# EAGLE design quadESP_DevKit_v1 (EAGLE 9.6.2)
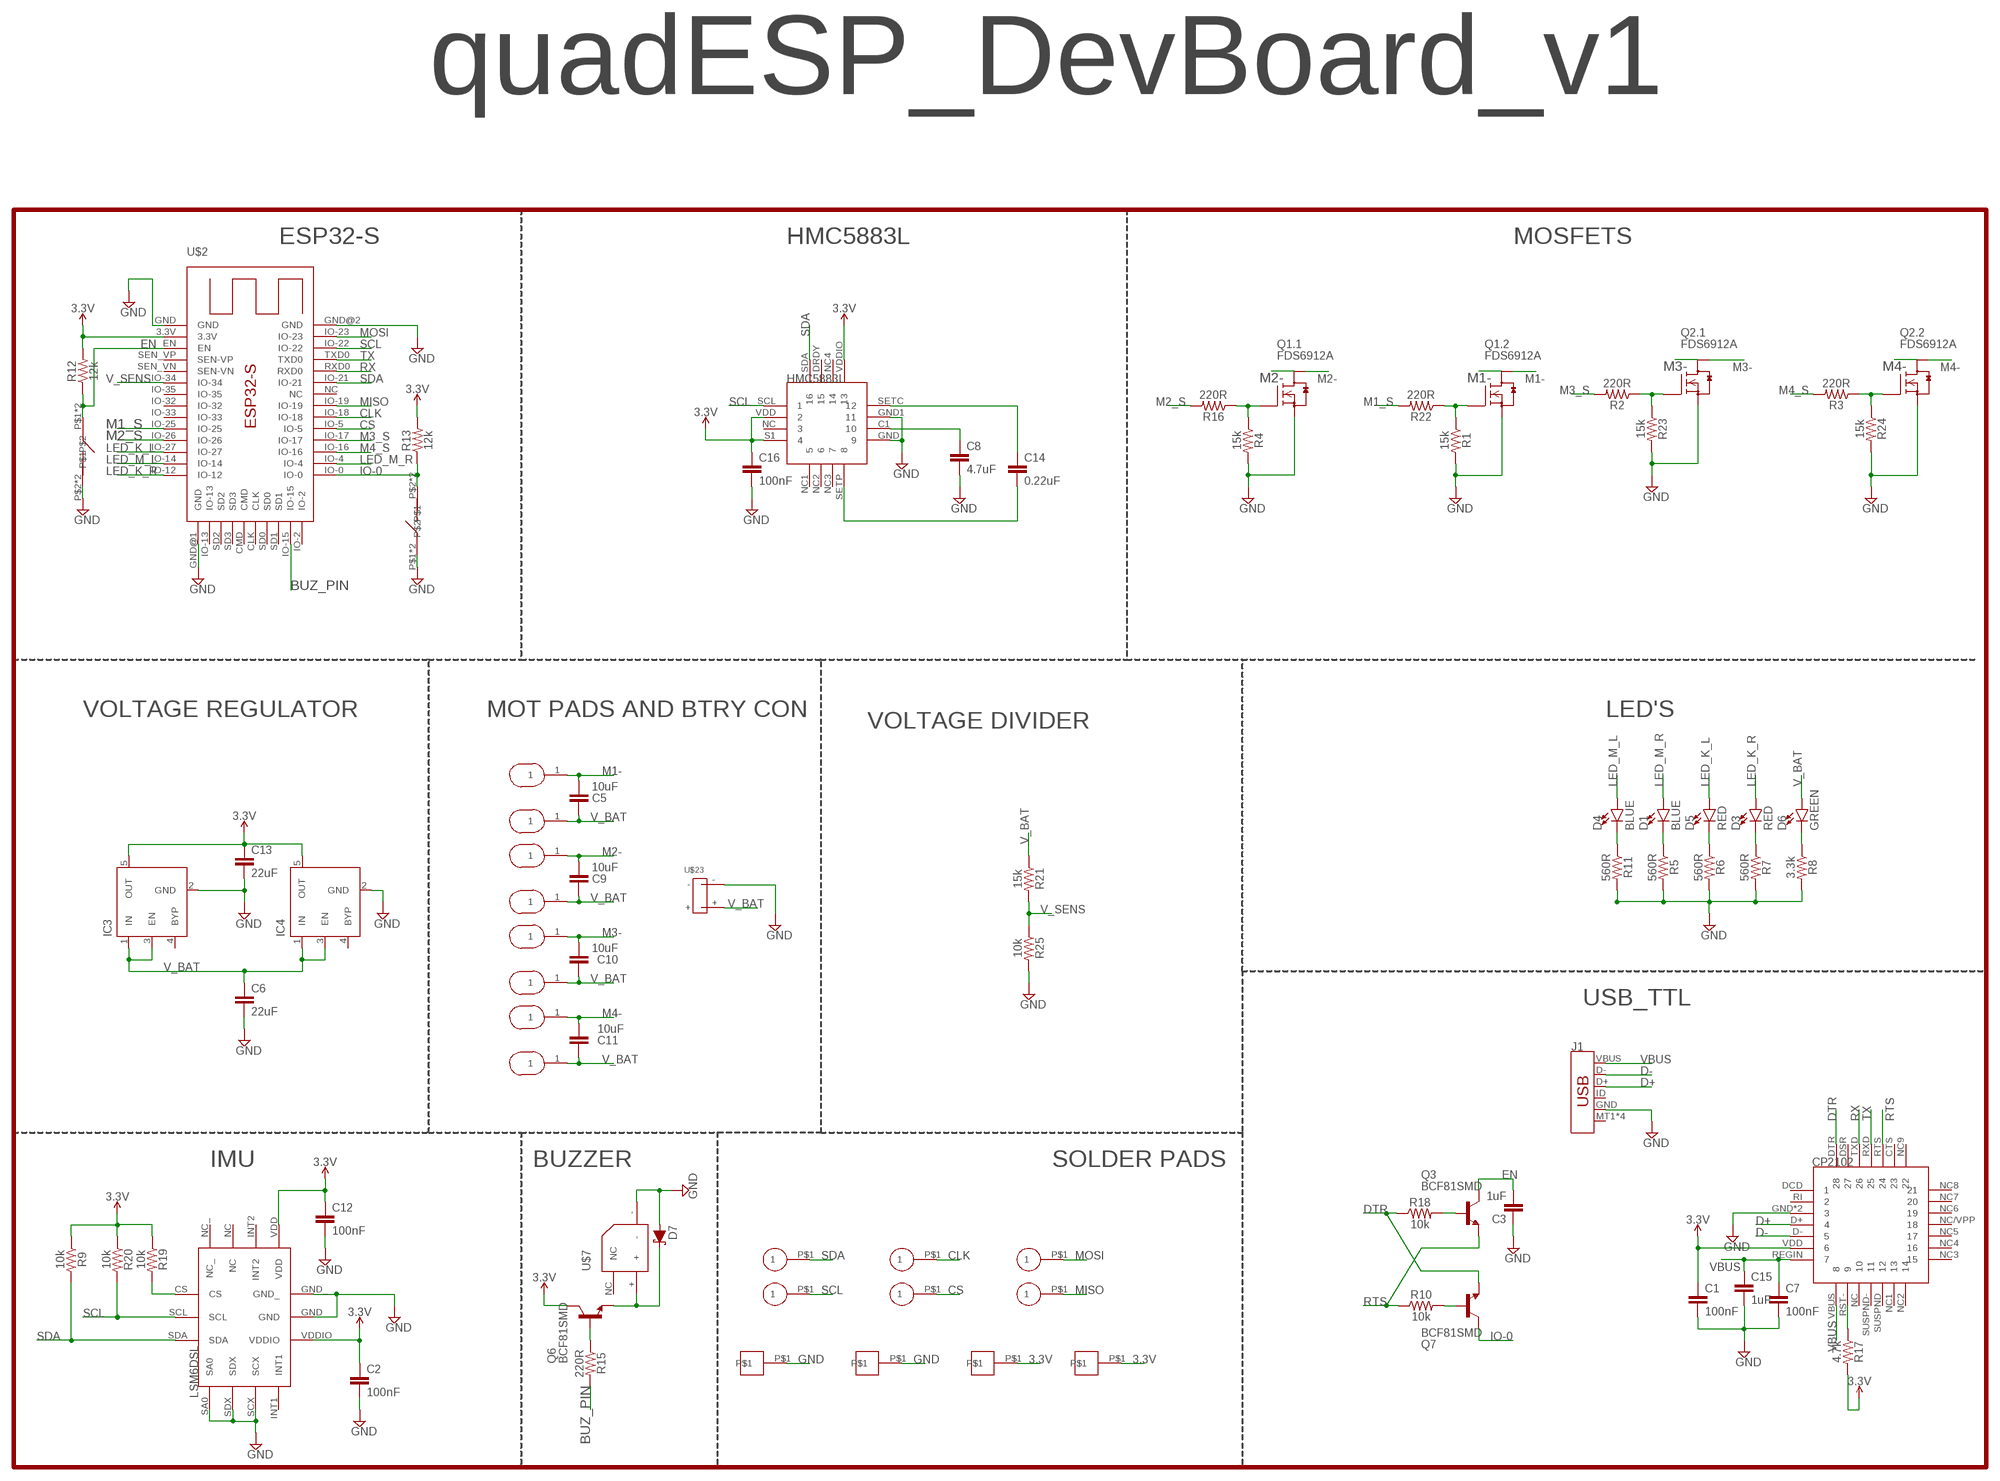
[diagram p0: schematic, sheet 1]

## Parts
C1  100nF  2.2UF-0603-10V-20%  [0603]
C2  100nF  2.2UF-0603-10V-20%  [0603]
C3  1uF  2.2UF-0603-10V-20%  [0603]
C5  10uF  2.2UF-0603-10V-20%  [0603]
C6  22uF  2.2UF-0603-10V-20%  [0603]
C7  100nF  2.2UF-0603-10V-20%  [0603]
C8  4.7uF  2.2UF-0603-10V-20%  [0603]
C9  10uF  2.2UF-0603-10V-20%  [0603]
C10  10uF  2.2UF-0603-10V-20%  [0603]
C11  10uF  2.2UF-0603-10V-20%  [0603]
C12  100nF  2.2UF-0603-10V-20%  [0603]
C13  22uF  2.2UF-0603-10V-20%  [0603]
C14  0.22uF  2.2UF-0603-10V-20%  [0603]
C15  1uF  2.2UF-0603-10V-20%  [0603]
C16  100nF  2.2UF-0603-10V-20%  [0603]
D1  BLUE  LED-BLUE0603  [LED-0603]
D3  RED  LED-RED0603  [LED-0603]
D4  BLUE  LED-BLUE0603  [LED-0603]
D5  RED  LED-RED0603  [LED-0603]
D6  GREEN  LED-GREEN0603  [LED-0603]
D7  120mA/40V/370mV  DIODE-SCHOTTKY-RB751S40  [SOD-523]
IC3  MIC5219XX  [SOT23-5]
IC4  MIC5219XX  [SOT23-5]
J1  USB_MICRO-B_SMT  [USB-MICROB]
Q1  FDS6912A  [SO-8]
Q2  FDS6912A  [SO-8]
Q3  BCF81SMD  [SOT23-BEC]
Q6  BCF81SMD  [SOT23-BEC]
Q7  BCF81SMD  [SOT23-BEC]
R1  15k  12KOHM-0603-1/10W-1%  [0603]
R2  220R  12KOHM-0603-1/10W-1%  [0603]
R3  220R  12KOHM-0603-1/10W-1%  [0603]
R4  15k  12KOHM-0603-1/10W-1%  [0603]
R5  560R  12KOHM-0603-1/10W-1%  [0603]
R6  560R  12KOHM-0603-1/10W-1%  [0603]
R7  560R  12KOHM-0603-1/10W-1%  [0603]
R8  3.3k  12KOHM-0603-1/10W-1%  [0603]
R9  10k  12KOHM-0603-1/10W-1%  [0603]
R10  10k  12KOHM-0603-1/10W-1%  [0603]
R11  560R  12KOHM-0603-1/10W-1%  [0603]
R12  12k  12KOHM-0603-1/10W-1%  [0603]
R13  12k  12KOHM-0603-1/10W-1%  [0603]
R15  220R  12KOHM-0603-1/10W-1%  [0603]
R16  220R  12KOHM-0603-1/10W-1%  [0603]
R17  4.7k  12KOHM-0603-1/10W-1%  [0603]
R18  10k  12KOHM-0603-1/10W-1%  [0603]
R19  10k  12KOHM-0603-1/10W-1%  [0603]
R20  10k  12KOHM-0603-1/10W-1%  [0603]
R21  15k  12KOHM-0603-1/10W-1%  [0603]
R22  220R  12KOHM-0603-1/10W-1%  [0603]
R23  15k  12KOHM-0603-1/10W-1%  [0603]
R24  15k  12KOHM-0603-1/10W-1%  [0603]
R25  10k  12KOHM-0603-1/10W-1%  [0603]
U$1  CP2102_SERIAL_TTL  [CP2102_SERIAL_TTL]
U$2  ESP32-S  [ESP32-S]
U$3  TACTILE_SWITCH_4X3X2  [TACTILE_SWITCH_4X3X2]
U$4  SOLDER_PAD_1.2_CIRCLE  [SOLDER_PAD_1.2_CIRCLE]
U$6  LSM6DSL_6DOF  [LSM6DSL_6DOF]
U$7  PASIVE_BUZZER_5MM_X_5MM_20MM  [PASIVE_BUZZER_5MM_X_5MM_20MM]
U$8  1.5X2.5_PAD  [1.5X2.5_PAD]
U$9  1.5X2.5_PAD  [1.5X2.5_PAD]
U$10  1.5X2.5_PAD  [1.5X2.5_PAD]
U$11  1.5X2.5_PAD  [1.5X2.5_PAD]
U$12  1.5X2.5_PAD  [1.5X2.5_PAD]
U$13  1.5X2.5_PAD  [1.5X2.5_PAD]
U$15  SOLDER_PAD_1.2_CIRCLE  [SOLDER_PAD_1.2_CIRCLE]
U$18  HMC5883L  [HMC5883L]
U$19  SOLDER_PAD_1.2_SQUARE  [SOLDER_PAD_1.2_SQUARE]
U$23  2X_SOLDER_PAD  [2X_SOLDER_PAD]
U$24  TACTILE_SWITCH_4X3X2  [TACTILE_SWITCH_4X3X2]
U$25  SOLDER_PAD_1.2_CIRCLE  [SOLDER_PAD_1.2_CIRCLE]
U$26  SOLDER_PAD_1.2_SQUARE  [SOLDER_PAD_1.2_SQUARE]
U$28  SOLDER_PAD_1.2_SQUARE  [SOLDER_PAD_1.2_SQUARE]
U$30  SOLDER_PAD_1.2_SQUARE  [SOLDER_PAD_1.2_SQUARE]
U$31  1.5X2.5_PAD  [1.5X2.5_PAD]
U$32  SOLDER_PAD_1.2_CIRCLE  [SOLDER_PAD_1.2_CIRCLE]
U$33  SOLDER_PAD_1.2_CIRCLE  [SOLDER_PAD_1.2_CIRCLE]
U$34  SOLDER_PAD_1.2_CIRCLE  [SOLDER_PAD_1.2_CIRCLE]
U$36  1.5X2.5_PAD  [1.5X2.5_PAD]

## Nets
3.3V: C1.1 C2.1 C12.1 C13.1 C16.1 IC3.5(OUT) IC4.5(OUT) Q6.C R9.1 R12.2 R13.2 R17.2 R19.1 R20.1 U$1.VDD U$2.3.3V U$6.VDD U$6.VDDIO U$18.S1 U$18.VDD U$18.VDDIO U$28.P$1 U$30.P$1
BUZ_PIN: R15.2 U$2.IO-15
CLK: U$2.IO-18 U$25.P$1
CS: U$2.IO-5 U$32.P$1
D+: J1.D+ U$1.D+
D-: J1.D- U$1.D-
DTR: Q7.E R18.1 U$1.DTR
EN: C3.2 Q3.C R12.1 U$2.EN U$3.P$1 U$3.P$4
GND: C1.2 C2.2 C3.1 C6.2 C7.2 C8.2 C12.2 C13.2 C15.2 C16.2 D7.A IC3.2(GND) IC4.2(GND) J1.GND Q1.1(.2:S) Q1.3(.1:S) Q2.1(.2:S) Q2.3(.1:S) R1.2 R4.2 R5.2 R6.2 R7.2 R8.2 R11.2 R23.2 R24.2 R25.2 U$1.GND U$1.GND1 U$2.GND U$2.GND@1(GND) U$2.GND@2(GND) U$3.P$2 U$3.P$3 U$6.GND U$6.GND_ U$6.SA0 U$6.SCX U$6.SDX U$7.- U$18.GND U$18.GND1 U$19.P$1 U$23.- U$24.P$1 U$24.P$4 U$26.P$1
IO-0: Q7.C R13.1 U$2.IO-0 U$24.P$2 U$24.P$3
LED_K_L: D5.A U$2.IO-27
LED_K_R: D3.A U$2.IO-12
LED_M_L: D4.A U$2.IO-14
LED_M_R: D1.A U$2.IO-4
M1-: C5.2 Q1.7(.2:D) Q1.8(.2:D) U$31.1
M1_S: R22.2 U$2.IO-25
M2-: C9.2 Q1.5(.1:D) Q1.6(.1:D) U$36.1
M2_S: R16.2 U$2.IO-26
M3-: C10.2 Q2.5(.1:D) Q2.6(.1:D) U$9.1
M3_S: R2.2 U$2.IO-17
M4-: C11.1 Q2.7(.2:D) Q2.8(.2:D) U$11.1
M4_S: R3.2 U$2.IO-16
MISO: U$2.IO-19 U$34.P$1
MOSI: U$2.IO-23 U$33.P$1
N$1: D1.C R5.1
N$2: D5.C R6.1
N$3: D3.C R7.1
N$4: D6.C R8.1
N$5: D4.C R11.1
N$6: Q1.4(.1:G) R4.1 R16.1
N$7: Q1.2(.2:G) R1.1 R22.1
N$8: Q2.4(.1:G) R2.1 R23.1
N$9: Q2.2(.2:G) R3.1 R24.1
N$10: Q6.B R15.1
N$11: R17.1 U$1.RST-
N$12: D7.C Q6.E U$7.+
N$13: Q3.B R18.2
N$15: R19.2 U$6.CS
N$17: Q7.B R10.2
N$22: C14.2 U$18.SETP
N$26: C8.1 U$18.C1
N$27: C14.1 U$18.SETC
RTS: Q3.E R10.1 U$1.RTS
RX: U$1.TXD U$2.RXD0
SCL: R20.2 U$2.IO-22 U$6.SCL U$15.P$1 U$18.SCL
SDA: R9.2 U$2.IO-21 U$4.P$1 U$6.SDA U$18.SDA
TX: U$1.RXD U$2.TXD0
V_BAT: C5.1 C6.1 C9.1 C10.1 C11.2 D6.A IC3.1(IN) IC3.3(EN) IC4.1(IN) IC4.3(EN) R21.1 U$8.1 U$10.1 U$12.1 U$13.1 U$23.+
V_SENS: R21.2 R25.1 U$2.IO-34
VBUS: C7.1 C15.1 J1.VBUS U$1.REGIN U$1.VBUS
Unconnected: IC3.4(BYP) IC4.4(BYP) J1.ID J1.MT1(SHIELD) J1.MT2(SHIELD) J1.P$1(SHIELD) J1.P$2(SHIELD) U$1.CTS U$1.DCD U$1.DSR U$1.NC U$1.NC1 U$1.NC2 U$1.NC3 U$1.NC4 U$1.NC5 U$1.NC6 U$1.NC7 U$1.NC8 U$1.NC9 U$1.NC/VPP U$1.RI U$1.SUSPND U$1.SUSPND- U$2.CLK U$2.CMD U$2.IO-2 U$2.IO-13 U$2.IO-32 U$2.IO-33 U$2.IO-35 U$2.NC U$2.SD0 U$2.SD1 U$2.SD2 U$2.SD3 U$2.SEN_VN(SEN-VN) U$2.SEN_VP(SEN-VP) U$6.INT1 U$6.INT2 U$6.NC U$6.NC_ U$7.NC U$18.DRDY U$18.NC U$18.NC1 U$18.NC2 U$18.NC3 U$18.NC4

## Notes on the sheet
- quadESP_DevBoard_v1
- ESP32-S | HMC5883L | MOSFETS
- VOLTAGE REGULATOR | MOT PADS AND BTRY CON | LED'S
- VOLTAGE DIVIDER
- USB_TTL
- IMU | BUZZER | SOLDER PADS

## Library data of the parts
C1-C3 C5-C16 = SparkFun-Capacitors:2.2UF: 2.2µF ceramic capacitors A capacitor is a passive two-terminal electrical component used to store electrical energy temporarily in an electric field.; PROD_ID: CAP-07888; VALUE: 2.2uF
D1 D4 = SparkFun-LED:LED-BLUE: Blue SMD LED Used in manufacturing of various products at SparkFun Packages: 0603 - SMD 0603 package [Product Link] <http://www.digikey.com/product-detail/en/SMLE12BC7TT86/511-1589-2-ND/1641808> 1206 - SMD1206 package [Product Link] <http://www.digikey.com/product-detail/en/lite-on-inc/LTST-C150TBKT/160-1643-1-ND/573584> SparkFun Products: ESP8266 Thing-Dev Board <https://www.sparkfun.com/products/13711> RedBoard <https://www.sparkfun.com/products/12757>; PROD_ID: DIO-08575
D3 D5 = SparkFun-LED:LED-RED: Red SMD LED Used in manufacturing of most products at SparkFun Packages: 0603 - SMD 0603 package [Product Link] <http://docs.avagotech.com/docs/AV02-0551EN> 0603 SMART - SMD 0603 SMART package ( more efficient and expensive)[Product Link] <http://www.osram-os.com/Graphics/XPic2/00077099_0.pdf> 1206 - SMD1206 package [Product Link] <https://www.sparkfun.com/datasheets/DevTools/LilyPad/Q150OVS4.pdff> SparkFun Products: Pro Mini 328 -5V <https://www.sparkfun.com/products/821> RedBoard <https://www.sparkfun.com/products/12757> IOIO-OTG <https://www.sparkfun.com/products/13613>; PROD_ID: DIO-00819
D6 = SparkFun-LED:LED-GREEN: Green SMD LED Used in manufacturing of various products at SparkFun Packages: 0603 - SMD 0603 package [Product Link] <http://www.futureelectronics.com/en/technologies/semiconductors/optoelectronics/leds/Pages/9894312-LTST-C190GKT.aspx?CrossPart=HSMG-C190&IM=0> LilyPad 1206 - SMD1206 LilyPad package [Product Link] <http://www.futureelectronics.com/en/Technologies/Product.aspx?ProductID=IN150NGHARVATEKCORPORATION2049943&IM=0> 1206 - SMD1206 package [Product Link] <http://www.futureelectronics.com/en/technologies/semiconductors/optoelectronics/leds/Pages/8315665-LTST-C150KGKT.aspx?IM=0> 1206 Bottom Mount -SMD 1206 Bottom Mount [Product Link] <http://www.digikey.com/product-detail/en/lite-on-inc/LTST-C230KGKT/160-1456-1-ND/386854> SparkFun Products: Pro Mini 328 -5V <https://www.sparkfun.com/products/821> RedBoard <https://www.sparkfun.com/products/12757> MP3 Trigger <https://www.sparkfun.com/products/13720> Makey Makey <https://www.sparkfun.com/products/11076>; PROD_ID: DIO-00821
D7 = SparkFun-DiscreteSemi:DIODE-SCHOTTKY: Schottky diode A Schottky diode is a semiconductor diode which has a low forward voltage drop and a very fast switching action.; PROD_ID: DIO-11018
IC3 IC4 = v-reg-micrel:MIC5219XX: VOLTAGE REGULATOR; OC_FARNELL: unknown; OC_NEWARK: unknown
J1 = SparkFun-Connectors:USB_MICRO-B: USB Type Micro-B Connector Male/female and PTH/SMT variants SparkFun Products: SparkFun microB USB Breakout <https://www.sparkfun.com/products/12035> SparkFun USB microB Plug Breakout <https://www.sparkfun.com/products/10031> SparkFun ESP8266 Thing <https://www.sparkfun.com/products/13231>; PROD_ID: CONN-09505; SF_ID: PRT-08533
Q1 Q2 = m-pad-2.1:FDS6912A: Fairchild's FDS6912A Dual N-Channel Logic Level PowerTrench MOSFET General Description: These N-Channel Logic Level MOSFETs are produced using Fairchild Semiconductor's advanced PowerTrench process that has been especially tailored to minimize the on-state resistance and yet maintain superior switching performance. These devices are well suited for low voltage and battery powered applications where low in-line power loss and fast switching are required. Features: 6 A, 30 V. RDS(ON) = 28 mOhm @ VGS = 10 V RDS(ON) = 35 mOhm @ VGS = 4.5 V Fast switching speed Low gate charge High performance trench technology for extremely low RDS(ON) High power and current handling capability Please send any comments to: messi@users.sourceforge.net
Q3 Q6 Q7 = transistor-npn:BCF81*: NPN Transistor
R1-R11 R15-R25 = SparkFun-Resistors:12KOHM: 12kΩ resistor A resistor is a passive two-terminal electrical component that implements electrical resistance as a circuit element. Resistors act to reduce current flow, and, at the same time, act to lower voltage levels within circuits. - Wikipedia; PROD_ID: RES-10327; VALUE: 12k
R12 R13 = SparkFun-Resistors:12KOHM: 12kΩ resistor A resistor is a passive two-terminal electrical component that implements electrical resistance as a circuit element. Resistors act to reduce current flow, and, at the same time, act to lower voltage levels within circuits. - Wikipedia; PROD_ID: RES-10327
U$1 = CP2102_SERIAL_TTLlbr:CP2102_SERIAL_TTL
U$2 = ESP32-S:ESP32-S: ESP32-S WIFI/BLUETOOTH MICRO CONTROLLER IC size 18mm x 25.5mm pad size 1.5mm x 0.9mm
U$3 U$24 = TACTILE_SWITCH_4X3X2:TACTILE_SWITCH_4X3X2
U$4 U$15 U$25 U$32-U$34 = SOLDER_PAD:SOLDER_PAD_1.2_CIRCLE
U$6 = LSM6DLS:LSM6DSL_6DOF
U$7 = PASIVE_BUZZER_5MM_X_5MM_20MM:PASIVE_BUZZER_5MM_X_5MM_20MM: PASIVE_BUZZER_5MM_X_5MM_20MM
U$8-U$13 U$31 U$36 = 1.5X2.5_PAD:1.5X2.5_PAD
U$18 = HMC5883L:HMC5883L
U$19 U$26 U$28 U$30 = SOLDER_PAD:SOLDER_PAD_1.2_SQUARE
U$23 = 2 X 3mm_round_solder_pads:2X_SOLDER_PAD

## Board
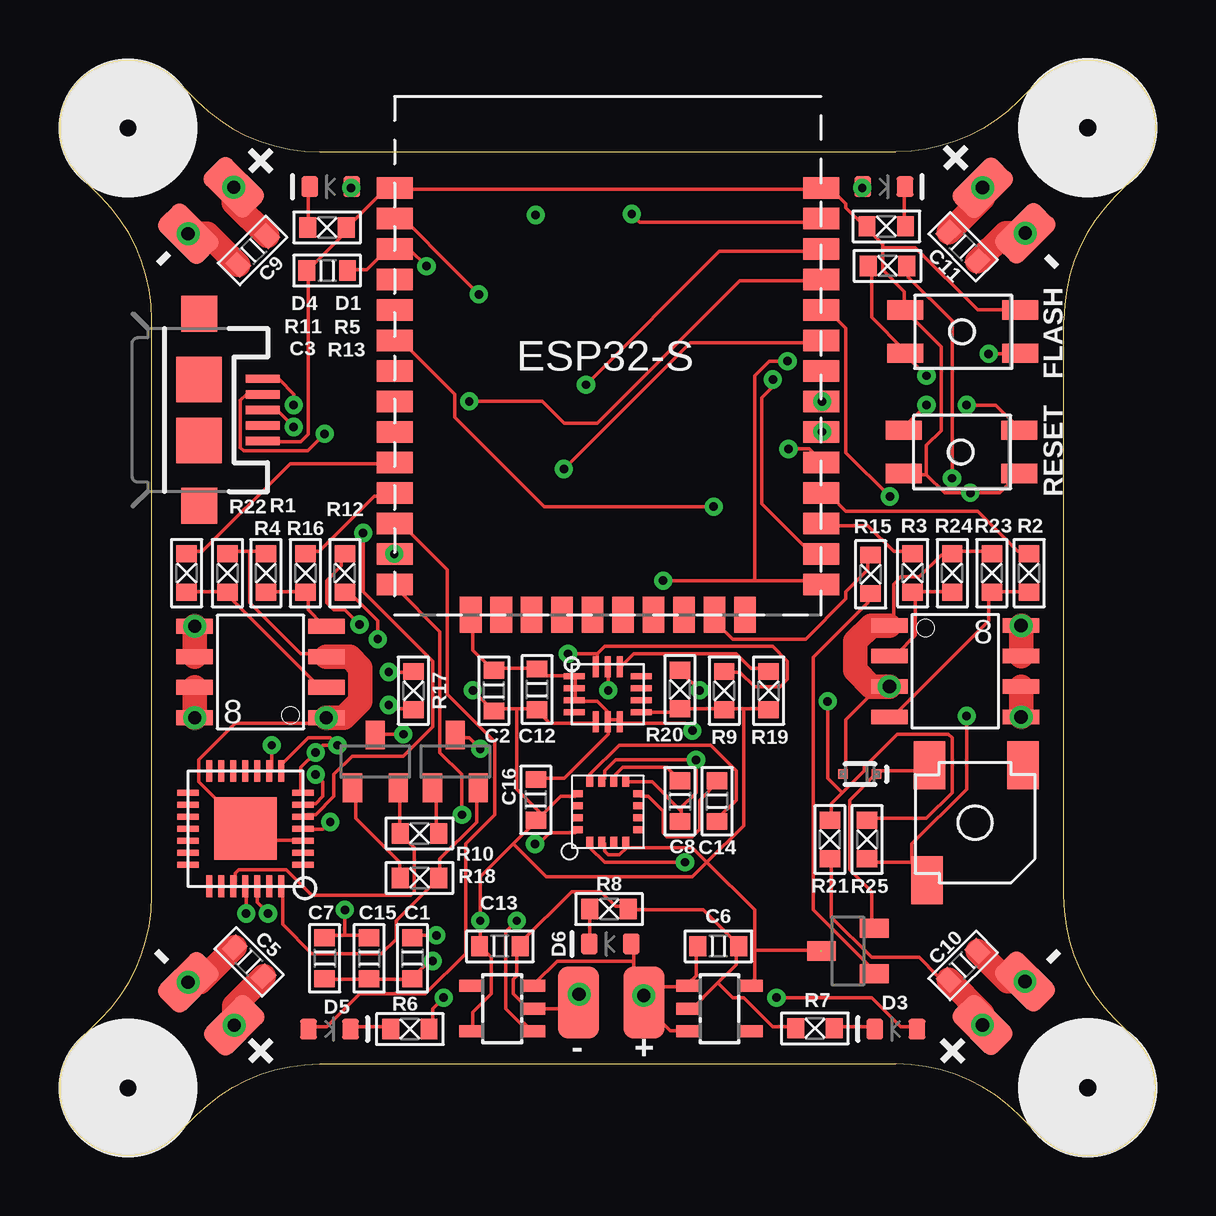
[diagram p1: board, top side]
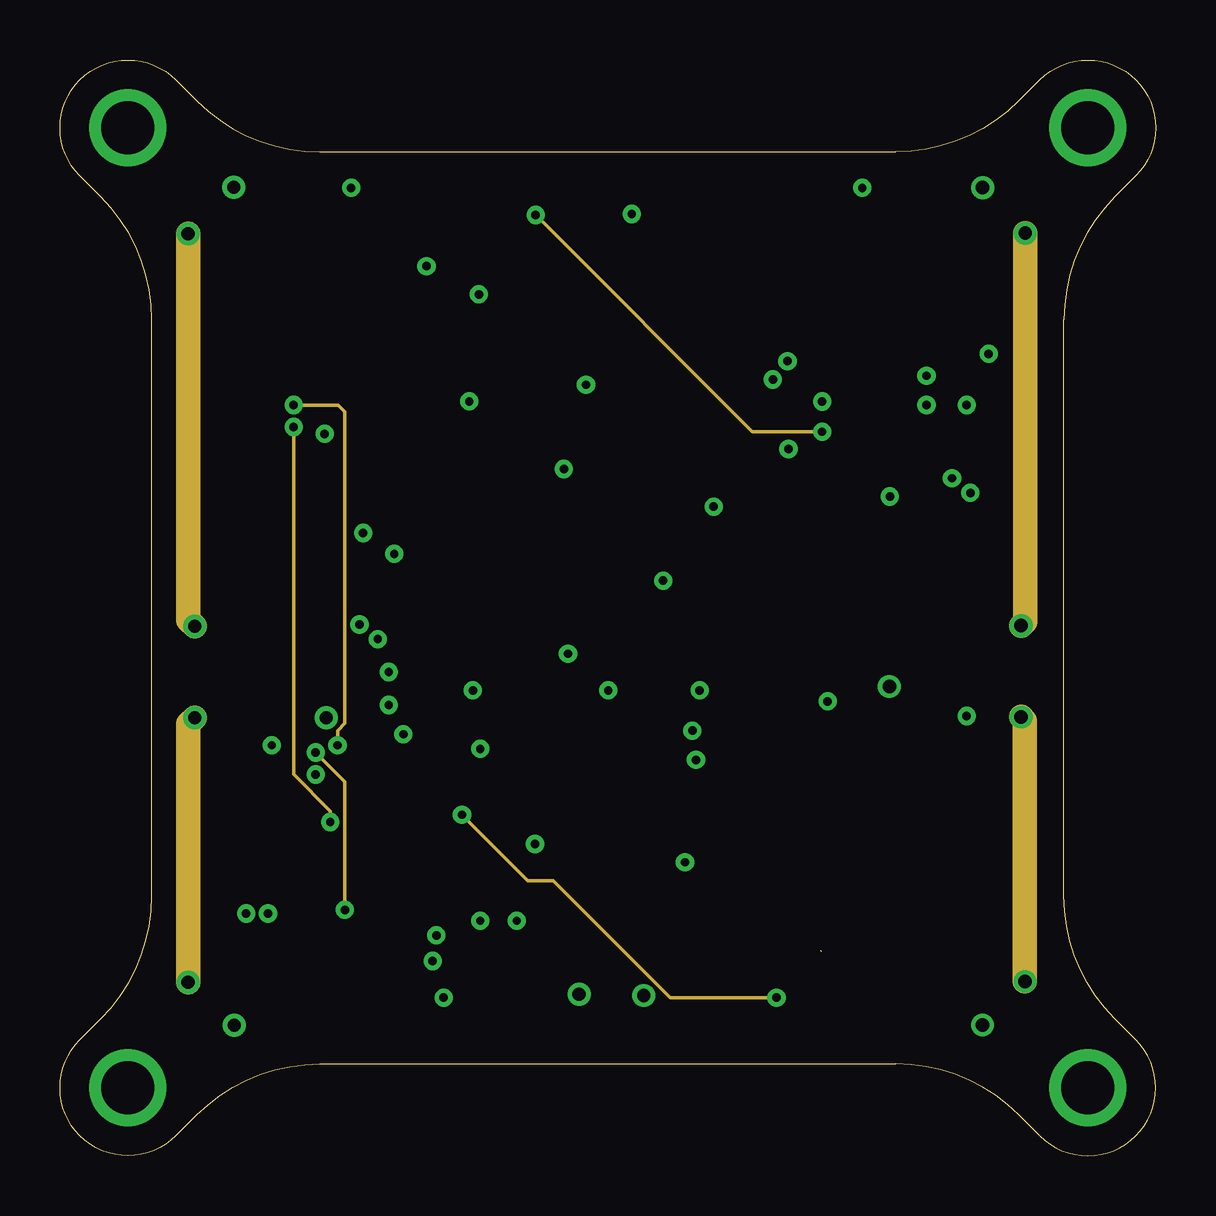
[diagram p2: board, inner layer Route2]
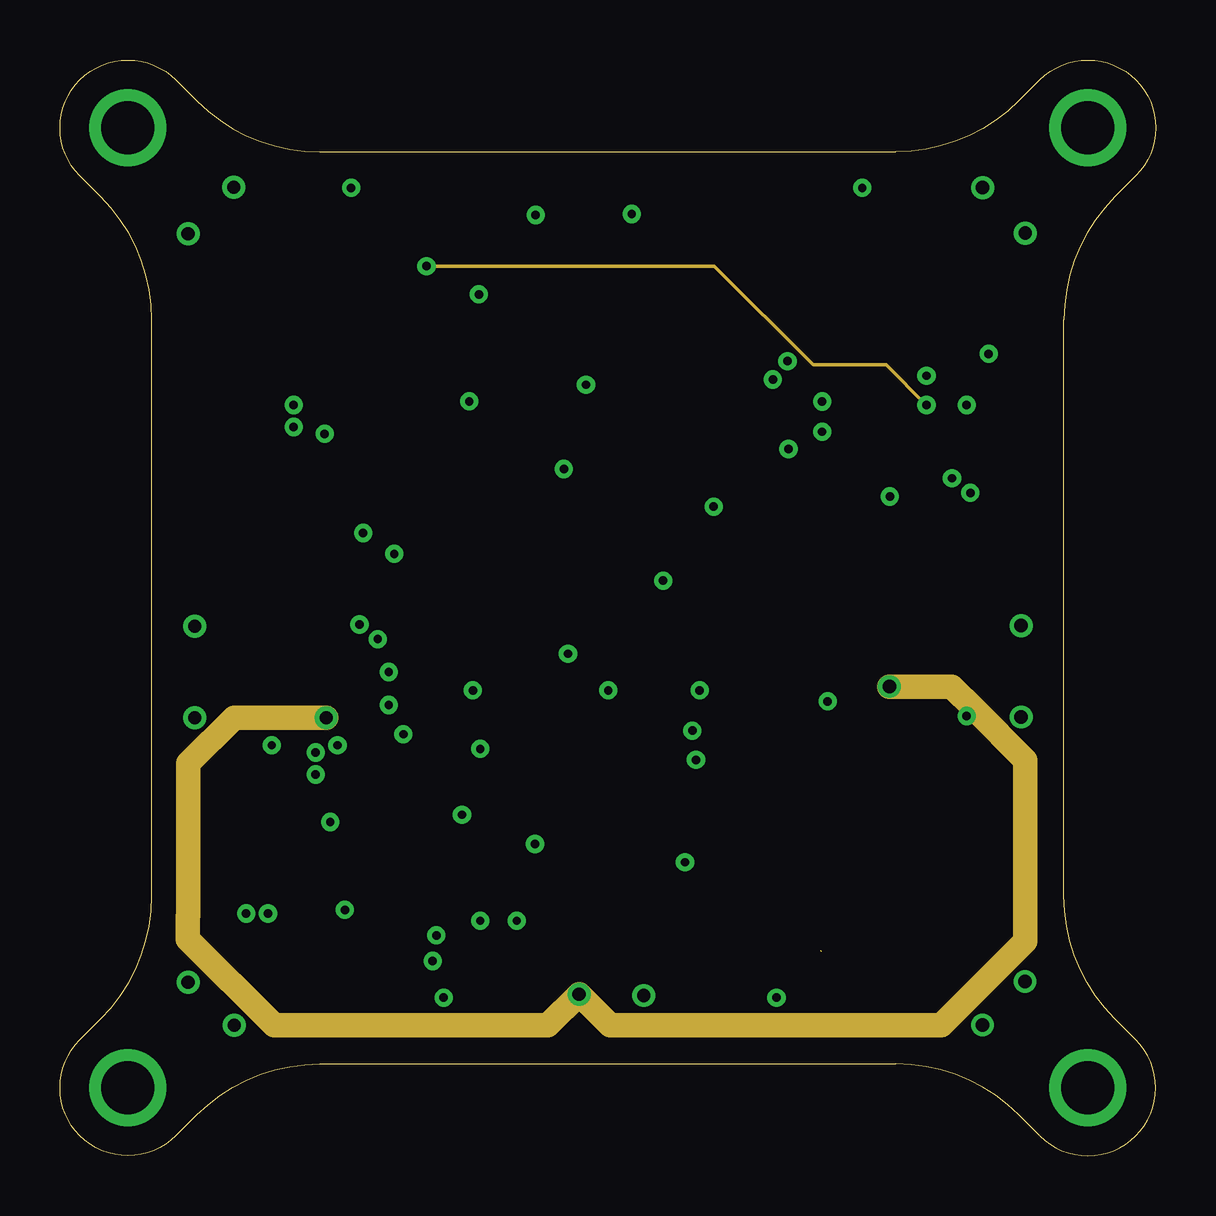
[diagram p3: board, inner layer Route15]
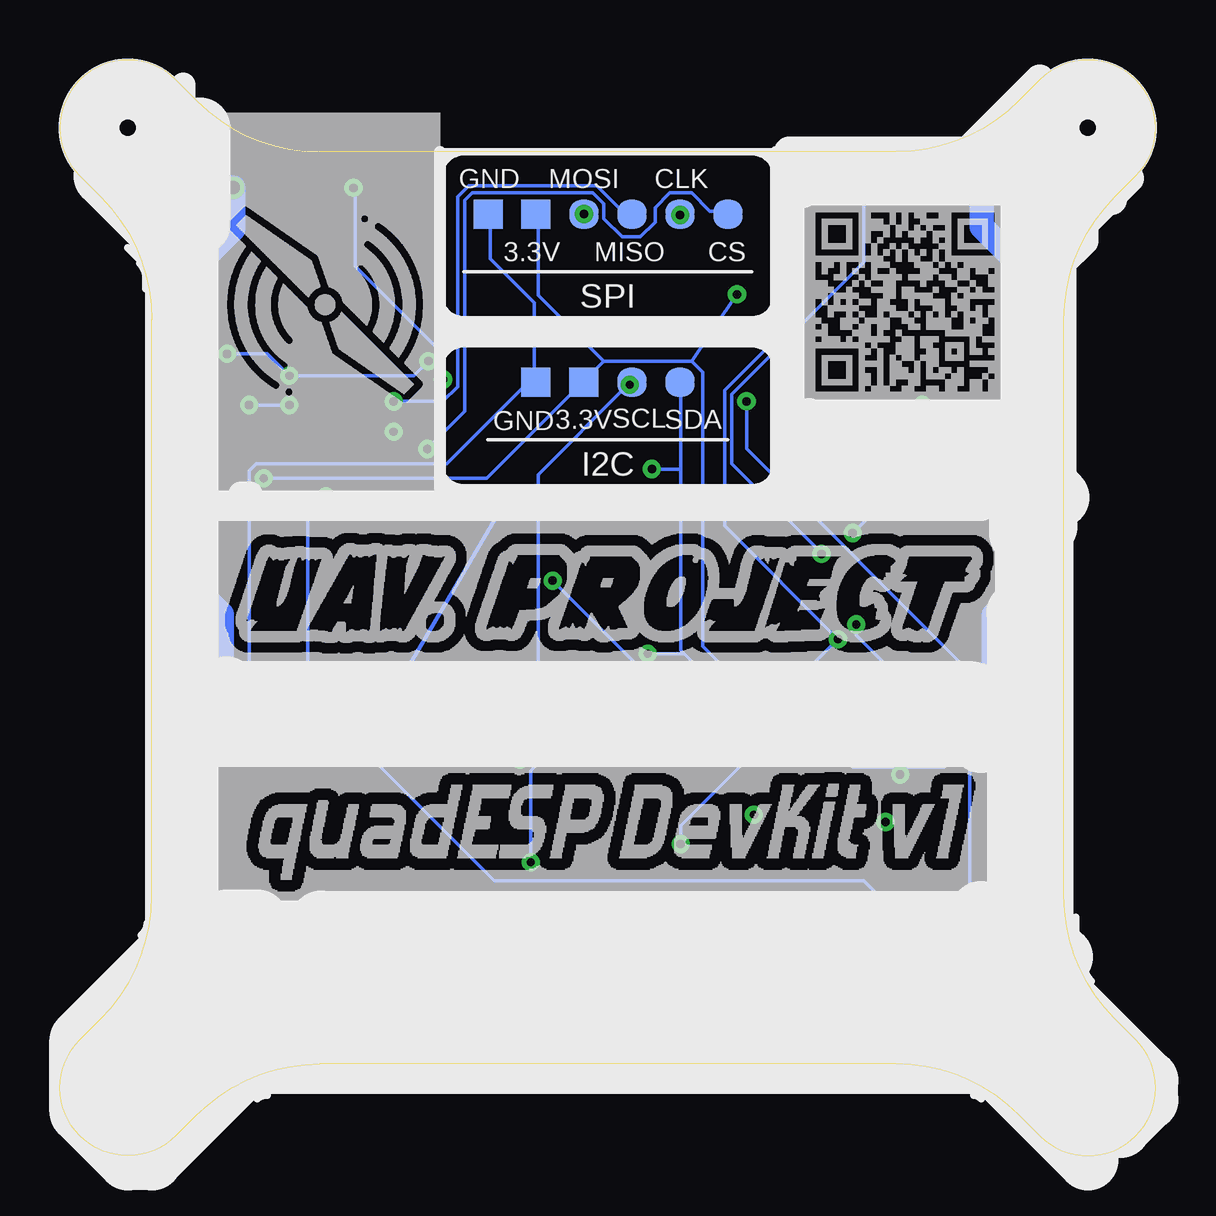
[diagram p4: board, bottom side, seen from below]

Size 45.66 x 45.66 mm. Coordinates in mm from the lower left corner, seen from the top.
Outline: 10.83,3.83 34.83,3.83 arc-45 39.95,1.71 40.83,0.83 arc180 44.83,4.83 43.95,5.71 arc-45 41.83,10.83 41.83,34.83 arc-45 43.95,39.95 44.83,40.83 arc180 40.83,44.83 39.95,43.95 arc-45 34.83,41.83 10.83,41.83 arc-45 5.71,43.95 4.83,44.83 arc180 0.83,40.83 1.71,39.95 arc-45 3.83,34.83 3.83,10.83 arc-45 1.71,5.71 0.83,4.83 arc180 4.83,0.83 5.71,1.71 arc-45 10.83,3.83
Copper layers (1+2*15+16): Top 0.035mm / dielectric 0.31mm / Route2 0.035mm / dielectric 0.73mm / Route15 0.035mm / dielectric 0.31mm / Bottom 0.035mm
Design rules "default *": minimum track width 6mil, minimum drill 0.35mm, track to track 6mil, track to pad 6mil, pad to pad 6mil, via to via 6mil, smd to smd 6mil, copper to edge 40mil, drill to drill 6mil, minimum pad ring 10mil, minimum via ring 8mil, stop-mask expansion 4mil, vias tented up to drill 0mil, thermal gap 10mil

### Footprints (pad centres in the part's own frame; a part is rotated, then mirrored left to right if it is on the bottom)
0603 = smd 0.7 x 0.85: 1 -0.85,0; 2 0.85,0
LED-0603 = smd 0.7 x 0.85: A -0.877,0; C 0.877,0
SOD-523 = smd 0.4 x 0.4: A -0.7,0; C 0.7,0
SOT23-5 = smd 0.5 x 1: 1 -0.95,-1.3; 2 0,-1.3; 3 0.95,-1.3; 4 0.95,1.3; 5 -0.95,1.3
USB-MICROB = smd 1.4 x 0.35: D+ -2.65,0; D- -2.65,-0.65; GND -2.65,1.3; ID -2.65,0.65; VBUS -2.65,-1.3 | smd 1.5 x 1.5: MT1 0,-4; MT2 0,4 | smd 1.9 x 1.9: P$1 0,-1.27; P$2 0,1.27
SO-8 = smd 1.524 x 0.61: 1 -2.743,1.27; 2 -2.743,0; 3 -2.743,-1.27; 4 -2.743,-2.54; 5 2.743,-2.54; 6 2.743,-1.27; 7 2.743,0; 8 2.743,1.27
SOT23-BEC = smd 0.8 x 1.2: B -0.95,-1.1; C 0,1.1; E 0.95,-1.1
0603' = smd 0.7 x 0.85: 1 -0.8,0; 2 0.8,0
CP2102_SERIAL_TTL = smd 0.25 x 0.9: CTS 1,2.4; DSR -1,2.4; DTR -1.5,2.4; NC -0.5,-2.4; NC1 1,-2.4; NC2 1.5,-2.4; NC9 1.5,2.4; RST- -1,-2.4; RTS 0.5,2.4; RXD 0,2.4; SUSPND 0.5,-2.4; SUSPND- 0,-2.4; TXD -0.5,2.4; VBUS -1.5,-2.4 | smd 0.9 x 0.25: D+ -2.4,0; D- -2.4,-0.5; DCD -2.4,1.5; GND -2.4,0.5; NC3 2.4,-1.5; NC4 2.4,-1; NC5 2.4,-0.5; NC6 2.4,0.5; NC7 2.4,1; NC8 2.4,1.5; NC/VPP 2.4,0; REGIN -2.4,-1.5; RI -2.4,1; VDD -2.4,-1 | smd 2.6 x 2.6: GND1 0,0
ESP32-S = smd 1.5 x 0.9: 3.3V -8.89,7.62; EN -8.89,6.35; GND -8.89,8.89; GND@2 8.89,8.89; IO-0 8.89,-7.62; IO-4 8.89,-6.35; IO-5 8.89,-2.54; IO-12 -8.89,-7.62; IO-14 -8.89,-6.35; IO-16 8.89,-5.08; IO-17 8.89,-3.81; IO-18 8.89,-1.27; IO-19 8.89,0; IO-21 8.89,2.54; IO-22 8.89,6.35; IO-23 8.89,7.62; IO-25 -8.89,-2.54; IO-26 -8.89,-3.81; IO-27 -8.89,-5.08; IO-32 -8.89,0; IO-33 -8.89,-1.27; IO-34 -8.89,2.54; IO-35 -8.89,1.27; NC 8.89,1.27; RXD0 8.89,3.81; SEN_VN -8.89,3.81; SEN_VP -8.89,5.08; TXD0 8.89,5.08 | smd 0.9 x 1.5: CLK 0.635,-8.89; CMD -0.635,-8.89; GND@1 -5.715,-8.89; IO-2 5.715,-8.89; IO-13 -4.445,-8.89; IO-15 4.445,-8.89; SD0 1.905,-8.89; SD1 3.175,-8.89; SD2 -3.175,-8.89; SD3 -1.905,-8.89
TACTILE_SWITCH_4X3X2 = smd 1.5 x 0.8: P$1 -2.432,0.908; P$2 -2.432,-0.892; P$3 2.368,-0.892; P$4 2.368,0.908
SOLDER_PAD_1.2_CIRCLE = smd 1.2 x 1.2: P$1 0,0
LSM6DSL_6DOF = smd 0.25 x 0.875: CS 0.5,1.2; GND 0,-1.1; GND_ 0.5,-1.1; SCL 0,1.2; SDA -0.5,1.2; VDDIO -0.5,-1.1 | smd 0.875 x 0.25: INT1 -1.4,-0.7; INT2 1.4,-0.2; NC 1.4,0.3; NC_ 1.4,0.8; SA0 -1.4,0.8; SCX -1.4,-0.2; VDD 1.4,-0.7 | smd 0.876 x 0.25: SDX -1.4,0.3
PASIVE_BUZZER_5MM_X_5MM_20MM = smd 2 x 1.3: + -2.4,-1.9; - 2.4,-2; NC -2.4,2
1.5X2.5_PAD = smd 2.5 x 1.5: 1 0,0
HMC5883L = smd 0.45 x 0.3: C1 1.27,-0.25; GND 1.27,-0.75; GND1 1.27,0.25; NC -1.27,-0.25; S1 -1.27,-0.75; SCL -1.27,0.75; SETC 1.27,0.75; VDD -1.27,0.25 | smd 0.3 x 0.45: DRDY -0.25,1.28; NC1 -0.75,-1.28; NC2 -0.25,-1.28; NC3 0.25,-1.28; NC4 0.25,1.28; SDA -0.75,1.28; SETP 0.75,-1.28; VDDIO 0.75,1.28
SOLDER_PAD_1.2_SQUARE = smd 1.2 x 1.2: P$1 0,0
2X_SOLDER_PAD = smd 3 x 1.7: + 0,-2; - 0,0.73

### Placement (x,y rotation side)
C1  14.68,8.23 270 top
C2  18.08,19.38 90 top
C3  11.13,36.88 0 top
C5  7.88,8.08 135 top
C6  27.43,8.73 0 top
C7  11.03,8.23 270 top
C8  25.83,14.78 270 top
C9  8.03,37.73 225 top
C10  37.63,7.93 45 top
C11  37.63,37.88 135 top
C12  19.88,19.43 90 top
C13  18.33,8.73 0 top
C14  27.38,14.78 90 top
C15  12.88,8.23 270 top
C16  19.83,14.83 90 top
D1  34.33,40.38 0 top
D3  34.83,5.28 180 top
D4  11.28,40.38 180 top
D5  11.23,5.28 0 top
D6  22.93,8.83 180 top
D7  33.32,15.9 0 top
IC3  27.48,6.13 270 top
IC4  18.43,6.13 90 top
J1  5.8,31.08 180 top
Q1  8.35,19.52 180 top
Q2  37.3,20.82 0 top
Q3  13.14,16.43 0 top
Q6  32.83,8.53 90 top
Q7  16.47,16.43 0 top
R1  15k  [0603']  6.98,24.28 90 top
R2  220R  [0603']  40.38,24.28 90 top
R3  220R  [0603']  35.53,24.28 90 top
R4  15k  [0603']  8.58,24.28 90 top
R5  560R  [0603']  34.43,38.73 180 top
R6  560R  [0603']  14.58,5.28 0 top
R7  560R  [0603']  31.46,5.31 180 top
R8  3.3k  [0603']  22.88,10.28 0 top
R9  10k  [0603']  27.68,19.38 90 top
R10  10k  [0603']  14.98,13.43 0 top
R11  560R  [0603']  11.13,38.68 0 top
R12  12k  [0603']  11.87,24.28 90 top
R13  12k  [0603']  34.48,37.08 0 top
R15  220R  [0603']  33.78,24.23 90 top
R16  220R  [0603']  10.23,24.28 90 top
R17  4.7k  [0603']  14.73,19.38 270 top
R18  10k  [0603']  14.98,11.58 180 top
R19  10k  [0603']  29.53,19.38 90 top
R20  10k  [0603']  25.83,19.43 90 top
R21  15k  [0603']  32.08,13.18 90 top
R22  220R  [0603']  5.28,24.28 90 top
R23  15k  [0603']  38.83,24.28 90 top
R24  15k  [0603']  37.18,24.28 90 top
R25  10k  [0603']  33.63,13.18 270 top
U$1  7.73,13.63 180 top
U$2  22.83,31.43 0 top
U$3  37.59,29.32 0 top
U$4  19.83,32.23 0 bottom
U$6  22.83,19.18 0 top
U$7  38.13,13.88 270 top
U$8  7.24,40.36 135 top
U$9  40.21,7.26 135 top
U$10  38.44,5.45 135 top
U$11  40.21,38.45 45 top
U$12  38.44,40.34 45 top
U$13  7.26,5.43 45 top
U$15  21.83,32.23 0 bottom
U$18  22.83,14.33 90 top
U$19  25.83,32.23 0 bottom
U$23  22.33,6.38 90 top
U$24  37.64,34.33 0 top
U$25  19.83,39.23 0 bottom
U$26  27.82,39.23 0 bottom
U$28  23.83,32.23 0 bottom
U$30  25.83,39.23 0 bottom
U$31  5.34,7.23 45 top
U$32  17.83,39.23 0 bottom
U$33  23.83,39.23 0 bottom
U$34  21.83,39.23 0 bottom
U$36  5.33,38.41 135 top

### Tracks (layer width: path | path; a pad name or v marks a point on that pad's centre or on a via)
3.3V  (via drill 0.35)  (1 unrouted)
  Top 0.152: U$6.VDD 24.37,18.48 25.74,18.48 R20.1 25.89,18.63 27.57,18.63 R9.1 27.72,18.63 28.48,18.63 | 28.48,18.63 29.4,18.63 R19.1 | 23.6,12.84 23.3,12.53 22.84,12.53 22.69,12.69 22.69,12.99 U$18.VDD | 23.6,12.84 23.6,12.99 U$18.S1 23.6,12.84 | 23.6,12.84 26.35,12.84 26.96,12.23 | 26.96,12.23 28.94,10.25 28.94,8.57 | 28.94,8.57 28.94,7.35 28.79,7.2 IC3.5 | 28.94,8.57 31.68,8.57 | 28.48,18.63 28.48,13.75 26.96,12.23 | v15.68,9.18 14.77,9.18 C1.1 | IC4.5 17.2,5.22 17.2,5.98 17.97,6.74 17.97,8.27 17.51,8.72 C13.1 17.51,8.88 v17.51,9.79 17.51,11.62 18.88,12.99 | 20.1,14.21 19.95,14.06 C16.1 | 20.1,14.21 20.86,14.97 21.47,14.97 U$18.VDDIO | 19.03,18.63 19.79,18.63 C12.1 19.95,18.48 20.4,18.02 22.23,18.02 U$6.VDDIO | 19.03,18.63 18.12,18.63 C2.1 17.97,18.63 v17.2,19.39 | 20.1,14.21 19.03,15.28 19.03,18.63 | 20.1,14.21 C16.1 | 18.88,12.99 19.79,13.91 C16.1 | 26.96,12.23 26.35,11.62 20.25,11.62 18.88,12.99 | v13.7,18.78 13.85,18.63 14.61,18.63 R17.2 | v12.48,22.14 11.87,22.75 11.41,22.75 11.11,23.05 11.11,23.96 11.72,24.57 11.72,25.03 R12.2 | v37.17,28.23 37.17,34.78 35.34,36.61 35.34,37.07 R13.2 | v10.65,15.89 10.96,15.58 10.96,14.97 10.65,14.67 10.19,14.67 U$1.VDD | v17.45,35.89 16.29,37.07 14.46,38.9 14,38.9 U$2.3.3V
  Bottom 0.152: v15.68,9.18 16.9,9.18 v17.51,9.79 | 13.7,17.26 v13.7,18.78 | 13.7,17.26 14,16.95 14.61,16.95 17.05,19.39 | 17.05,19.39 18.88,21.22 18.88,32.65 19.34,33.11 | 23,33.11 19.34,33.11 | 23,33.11 23.76,32.35 U$28.P$1 23.91,32.19 27.87,28.23 v37.17,28.23 | v12.48,22.14 12.48,21.68 8.21,17.41 8.21,16.8 8.82,16.19 10.65,16.19 | 10.65,16.19 12.63,16.19 13.7,17.26 | 10.65,16.19 v10.65,15.89 | 23,33.11 25.74,35.85 25.74,39.2 U$30.P$1 | 19.34,33.11 v17.45,35.89 | 17.05,19.39 v17.2,19.39
BUZ_PIN
  Top 0.152: R15.2 33.66,24.88 33.66,24.42 32.75,23.51 32.75,23.2 31.07,21.53 28.02,21.53 27.41,22.14 27.41,22.44 U$2.IO-15
CLK  (via drill 0.35)
  Top 0.152: v31.75,30.17 U$2.IO-18
  Route2 0.152: v31.75,30.17 28.85,30.17 v19.82,39.2
  Bottom 0.152: U$25.P$1 v19.82,39.2
CS  (via drill 0.35)
  Top 0.152: v30.35,29.45 31.22,29.45 31.68,28.99 U$2.IO-5
  Bottom 0.152: v30.35,29.45 28.79,31.02 28.79,39.81 28.48,40.12 23.45,40.12 23,39.66 23,39.05 22.23,38.29 21.47,38.29 20.86,38.9 20.86,39.51 20.25,40.12 19.34,40.12 18.58,39.36 17.97,39.36 U$32.P$1
D+  (via drill 0.35)
  Top 0.152: v11.26,13.91 10.96,13.6 10.19,13.6 U$1.D+ | v9.74,30.37 9.13,30.97 8.52,30.97 J1.D+
  Route2 0.152: v11.26,13.91 11.26,14.36 9.74,15.89 v9.74,30.37
D-  (via drill 0.35)
  Top 0.152: v12.63,25.95 12.63,23.51 15.53,20.61 15.53,17.87 14.31,16.65 12.17,16.65 11.41,15.89 11.41,14.97 10.65,14.21 10.19,14.21 U$1.D- | J1.D- 7.78,31.73 7.52,31.47 7.52,29.51 7.65,29.37 10.32,29.37 v11.03,30.08
  Bottom 0.152: v11.03,30.08 11.03,27.55 v12.63,25.95
DTR
  Top 0.152: Q7.E 17.36,15.28 17.36,13.91 15.83,12.38 15.83,11.62 R18.1 15.68,11.47 14,9.79 14,9.03 13.39,8.42 10.5,8.42 9.28,9.64 9.28,11.16 U$1.DTR
EN  (via drill 0.35)
  Top 0.152: v36.1,31.28 35.19,30.37 U$3.P$1 | v37.78,31.28 39,31.28 39.91,30.37 U$3.P$4 | C3.2 12.02,36.92 12.78,36.92 13.55,37.68 13.85,37.68 U$2.EN 14.56,37.78 v15.27,37.07 | v13.24,21.53 13.24,22.29 12.17,23.35 11.87,23.35 R12.1 | v14.31,17.56 13.24,17.56 Q3.C
  Route15 0.152: v36.1,31.28 34.43,32.96 31.38,32.96 27.27,37.07 v15.27,37.07
  Bottom 0.152: v37.78,31.28 v36.1,31.28 | v14.31,17.56 14.31,20.46 v13.24,21.53 17.97,26.25 17.97,31.89 15.27,34.58 v15.27,37.07
GND  (via drill 0.35, 0.55)
  Top 0.152: J1.GND 8.52,29.76 10.04,29.76 10.35,30.06 10.35,36.77 C3.1 10.35,36.92 12.02,38.59 R11.2 12.02,38.75 13.55,40.27 13.85,40.27 U$2.GND 14,40.27 31.68,40.27 U$2.GND@2 31.83,40.27 32.14,40.27 32.75,39.66 32.75,39.51 33.51,38.75 R5.2 33.66,38.59 34.27,37.99 34.27,37.83 | 36.1,28.38 35.19,28.38 U$3.P$2 | 36.1,28.38 36.86,27.62 v37.93,27.62 39.15,27.62 39.91,28.38 U$3.P$3 | 34.27,37.83 34.27,36.92 35.19,36 35.19,35.24 U$24.P$1 35.34,35.09 36.71,33.72 36.71,30.21 36.1,29.6 36.1,28.38 | 34.27,37.83 35.64,37.83 38.24,35.24 39.91,35.24 U$24.P$4 | C16.2 19.95,15.73 21.01,15.73 22.84,17.56 22.84,18.02 U$6.GND 22.84,18.17 | 22.84,18.17 23.3,18.17 U$6.GND_ 23.45,18.02 26.04,18.02 v26.35,17.72 | U$2.GND@1 17.2,22.44 17.2,21.07 17.97,20.31 C2.2 18.12,20.31 19.79,20.31 C12.2 19.95,20.15 20.1,20 21.32,20 U$6.SA0 21.47,20 21.47,19.54 U$6.SDX 21.47,19.39 21.47,19.09 U$6.SCX 21.47,18.94 22.39,18.94 22.84,18.48 22.84,18.17 | 27.41,7.2 26.2,5.98 IC3.2 | 27.41,7.2 28.18,7.96 28.18,8.72 C6.2 28.18,8.88 26.81,10.25 23.76,10.25 R8.2 23.6,10.4 23.15,10.4 22.54,11.01 21.32,11.01 19.19,8.88 C13.2 19.03,8.72 19.03,7.51 18.88,7.35 18.88,6.74 19.64,5.98 IC4.2 19.79,6.13 21.32,6.13 21.47,6.29 v21.63,6.73 21.47,6.44 U$23.- | 27.41,7.2 28.02,6.59 28.48,6.59 29.7,5.37 30.62,5.37 R7.2 | U$1.GND 10.04,13.14 8.21,13.14 7.76,13.6 U$1.GND1 7.6,13.75 5.77,15.58 5.77,16.5 7.3,18.02 10.65,18.02 Q1.1 | 35.49,12.23 33.66,12.23 R25.2 | 35.49,12.23 36.1,11.62 U$7.- 35.49,12.23 | 26.35,16.34 26.5,16.19 26.5,15.13 25.89,14.52 25.89,14.36 | 26.35,16.34 26.2,16.5 23.15,16.5 22.69,16.04 22.69,15.73 U$18.GND1
  Top 0.152: 25.89,14.36 25.89,14.06 C8.2 | 25.89,14.36 24.67,15.58 23.6,15.58 U$18.GND | C7.2 11.11,7.35 12.78,7.35 C15.2 12.94,7.35 14.61,7.35 C1.2 14.77,7.51 15.38,8.11 v15.53,8.11 | R23.2 38.69,25.18 37.32,25.18 R24.2 37.17,25.03 36.71,25.03 35.8,24.12 35.03,24.12 34.73,23.81 34.73,22.59 Q2.1 | 7.91,25.18 8.52,25.18 R4.2 | 7.91,25.18 6.99,25.18 R1.2 | D7.A 32.75,16.04 32.75,18.17 33.66,19.09 33.8,19.55 | v15.98,6.59 15.53,6.13 15.53,5.37 R6.2 | 7.91,25.18 7.91,23.05 10.04,20.92 10.65,20.92 Q1.3 | v26.5,16.5 26.35,16.34 | 35.49,12.23 35.49,12.99 37.78,15.28 v37.78,18.33
  Top 1.016: Q1.1 11.83,18.25 12.52,18.94 12.52,20.34 12.06,20.79 Q1.3 | Q2.3 33.8,19.55 33.13,20.23 33.13,21.43 33.79,22.09 Q2.1
  Route15 0.152: v37.78,18.33 38.09,18.63
  Route15 1.016: Q2.3 37.17,19.55 38.09,18.63 40.23,16.49 40.23,8.93 36.73,5.43 22.93,5.43 v21.63,6.73 20.33,5.43 8.93,5.43 5.33,9.03 5.33,9.99 5.35,10.01 5.35,16.35 7.25,18.25 Q1.1
  Bottom 0.152: U$26.P$1 27.72,39.2 27.72,37.38 25.89,35.55 25.89,32.35 U$19.P$1 25.89,32.19 26.2,32.19 29.55,28.84 37.47,28.84 37.78,28.54 37.78,27.62 | v21.63,6.73 21.62,6.59 v15.98,6.59 15.53,7.05 v15.53,8.11 | Q2.3 34.43,19.54 31.38,16.5 v26.5,16.5 26.35,16.65 v26.35,17.72 | v37.78,18.33 37.78,27.62 | 37.78,27.62 v37.93,27.62
  other vias: 11.1,18.25 34.56,19.55
IO-0  (via drill 0.35)
  Top 0.152: R13.1 33.82,37.07 33.82,34.94 35.19,33.57 U$24.P$2 35.19,33.41 v36.1,32.5 | v38.69,33.41 39.91,33.41 U$24.P$3 | v17.51,16.95 17.05,17.41 16.59,17.41 Q7.C | 28.94,23.96 31.53,23.96 31.68,23.81 U$2.IO-0 | 28.94,23.96 v25.13,23.96 | v30.31,33.11 29.55,33.11 28.94,32.5 28.94,23.96
  Bottom 0.152: v38.69,33.41 37.02,33.41 v36.1,32.5 30.92,32.5 v30.31,33.11 | v17.51,16.95 18.12,16.95 v25.13,23.96
LED_K_L
  Top 0.152: D5.A 10.5,5.37 11.11,5.37 12.48,6.74 15.22,6.74 16.9,8.42 16.9,12.99 18.12,14.21 18.12,17.26 16.14,19.24 16.14,24.42 14.31,26.25 14,26.25 U$2.IO-27
LED_K_R  (via drill 0.35)
  Top 0.152: v29.85,6.59 33.82,6.59 35.03,5.37 35.64,5.37 D3.A | v16.75,14.21 16.75,15.89 15.83,16.8 15.83,21.83 14,23.66 U$2.IO-12
  Route2 0.152: v29.85,6.59 25.43,6.59 20.56,11.47 19.49,11.47 v16.75,14.21
LED_M_L  (via drill 0.35)
  Top 0.152: v12.13,40.33 12.17,40.42 D4.A | v13.93,25.08 14,25.18 U$2.IO-14
  Bottom 0.152: v12.13,40.33 12.17,40.27 12.17,37.22 17.66,31.74 17.66,28.84 14,25.18 v13.93,25.08
LED_M_R  (via drill 0.35)
  Top 0.152: v33.43,40.33 33.36,40.42 D1.A | v29.7,32.35 29.7,32.04 29.24,31.58 29.24,27.16 31.22,25.18 31.68,25.18 U$2.IO-4
  Bottom 0.152: v29.7,32.35 29.7,33.41 33.36,37.07 33.36,40.27 v33.43,40.33
LEFT_MOUNT  (via drill 2.2 pad 1.3)
  other vias: 2.83,2.83
M1-  (via drill 0.55)
  Top 1.016: Q1.7 Q1.8 | C5.2 5.83,7.23 U$31.1
  Route2 1.016: U$31.1 5.34,10.04 5.35,10.06 5.35,17.99 Q1.8
  other vias: 5.34,7.23 5.61,18.25
M1_S
  Top 0.152: R22.2 5.32,25.18 5.93,25.18 9.58,28.84 13.85,28.84 U$2.IO-25
M2-  (via drill 0.55)
  Top 1.016: Q1.6 Q1.5 | C9.2 6.14,38.41 U$36.1
  Route2 1.016: U$36.1 5.33,35.63 5.35,35.61 5.35,22.32 Q1.5
  other vias: 5.33,38.41 5.61,22.06
M2_S
  Top 0.152: R16.2 10.35,25.18 10.8,25.18 13.09,27.47 13.85,27.47 U$2.IO-26
M3-  (via drill 0.55)
  Top 1.016: Q2.6 Q2.5 | C10.2 39.5,7.26 U$9.1
  Route2 1.016: U$9.1 40.21,18.12 Q2.5
  other vias: 40.21,7.26 40.05,18.28
M3_S
  Top 0.152: R2.2 40.37,25.18 39.91,25.18 38.24,26.86 32.75,26.86 32.14,27.47 31.83,27.47 U$2.IO-17
M4-  (via drill 0.55)
  Top 1.016: Q2.7 Q2.8 | C11.1 39.4,38.45 U$11.1
  Route2 1.016: U$11.1 40.21,22.26 Q2.8
  other vias: 40.21,38.45 40.05,22.09
M4_S
  Top 0.152: R3.2 35.49,25.18 34.73,25.18 33.66,26.25 31.83,26.25 U$2.IO-16
MISO  (via drill 0.35)
  Top 0.152: v31.75,31.43 U$2.IO-19
  Bottom 0.152: v31.75,31.43 29.7,31.43 29.09,32.04 29.09,39.97 28.63,40.42 23.3,40.42 22.23,39.36 21.93,39.36 U$34.P$1
MOSI  (via drill 0.35)
  Top 0.152: v23.82,39.24 24.16,38.9 31.68,38.9 U$2.IO-23
  Bottom 0.152: v23.82,39.24 U$33.P$1
N$1
  Top 0.152: R5.1 35.19,38.75 35.19,40.27 D1.C
N$2
  Top 0.152: D5.C 12.17,5.37 13.7,5.37 R6.1
N$3
  Top 0.152: R7.1 32.29,5.37 33.82,5.37 D3.C
N$4
  Top 0.152: D6.C 22.08,8.88 22.08,10.25 R8.1
N$5
  Top 0.152: R11.1 10.35,38.75 10.35,40.27 D4.C
N$6
  Top 0.152: R4.1 8.67,23.51 10.19,23.51 R16.1 10.35,23.35 10.35,22.75 10.96,22.14 Q1.4
N$7
  Top 0.152: R22.1 5.32,23.51 6.84,23.51 R1.1 6.99,23.35 10.96,19.39 Q1.2
N$8
  Top 0.152: R2.1 40.37,23.51 38.84,23.51 R23.1 38.69,23.35 38.69,22.29 34.58,18.17 Q2.4
N$9
  Top 0.152: R24.1 37.17,23.51 35.64,23.51 R3.1 35.64,23.35 35.64,21.68 34.88,20.92 34.58,20.92 Q2.2
N$10
  Top 0.152: R15.1 33.66,23.35 33.66,23.05 31.38,20.76 31.38,10.25 33.97,7.66 Q6.B
N$11  (via drill 0.35)
  Top 0.152: v13.7,20.15 14.61,20.15 R17.1 | v8.82,17.11 8.82,16.04 U$1.RST-
  Bottom 0.152: v13.7,20.15 11.87,20.15 v8.82,17.11
N$12
  Top 0.152: U$7.+ 36.1,16.19 35.95,16.04 34.12,16.04 D7.C 33.97,15.89 32.9,14.82 32.9,11.92 33.82,11.01 33.82,9.49 Q6.E
N$13
  Top 0.152: R18.2 14.16,11.62 14.16,12.23 12.33,14.06 12.33,15.28 Q3.B
N$15
  Top 0.152: R19.2 29.4,20.31 28.79,20.31 28.18,20.92 23.91,20.92 23.45,20.46 U$6.CS
N$17
  Top 0.152: R10.2 15.68,13.45 15.68,15.13 15.53,15.28 Q7.B
N$18  (via drill 2.2 pad 1.3)
  other vias: 42.83,2.83
N$19  (via drill 2.2 pad 1.3)
  other vias: 42.83,42.83
N$20  (via drill 2.2 pad 1.3)
  other vias: 2.83,42.83
N$22
  Top 0.152: U$18.SETP 24.21,14.97 24.52,14.97 25.13,14.36 25.13,13.45 25.28,13.3 26.35,13.3 26.65,13.6 26.65,14.82 27.41,15.58 C14.2
N$26
  Top 0.152: U$18.C1 23.15,15.73 23.15,15.89 23.45,16.19 25.28,16.19 25.74,15.73 C8.1
N$27
  Top 0.152: U$18.SETC 22.08,15.73 22.08,15.89 23.3,17.11 27.11,17.11 28.18,16.04 28.18,14.82 27.41,14.06 C14.1
RTS
  Top 0.152: Q3.E 14.16,15.28 14.16,13.45 R10.1 14.31,13.3 14.77,12.84 14.77,11.01 14.61,10.86 10.5,10.86 9.43,11.92 7.45,11.92 7.3,11.77 7.3,11.32 U$1.RTS
RX  (via drill 0.35)
  Top 0.152: v8.67,10.1 8.21,10.55 8.21,11.16 U$1.TXD | v34.58,27.47 32.75,29.3 32.75,34.48 32.14,35.09 31.83,35.09 U$2.RXD0
  Bottom 0.152: v8.67,10.1 10.8,10.1 12.17,11.47 27.57,11.47 35.34,19.24 35.34,26.71 v34.58,27.47
SCL  (via drill 0.35)
  Top 0.152: v26.04,12.23 22.69,12.23 22.08,12.84 22.08,12.99 U$18.SCL | v26.65,19.39 25.89,20.15 R20.2 | v22.84,19.39 22.84,20.31 U$6.SCL | v21.92,32.13 27.47,37.68 31.68,37.68 U$2.IO-22
  Bottom 0.152: v26.04,12.23 26.04,16.04 25.74,16.34 25.74,19.39 | 25.74,19.39 25.74,28.38 22.08,32.04 U$15.P$1 21.93,32.19 21.96,32.17 v21.92,32.13 | 25.74,19.39 v26.65,19.39 | 25.74,19.39 v22.84,19.39
SDA  (via drill 0.35)
  Top 0.152: 22.39,20.92 22.69,21.22 29.7,21.22 30.31,20.61 30.31,19.85 30.01,19.54 28.94,19.54 28.33,20.15 27.72,20.15 R9.2 | 22.39,20.92 22.39,20.46 U$6.SDA | v19.79,12.99 19.95,12.99 20.4,13.45 21.47,13.45 U$18.SDA | v21,28.61 26.25,33.87 31.68,33.87 U$2.IO-21 | v21.17,20.92 22.39,20.92
  Bottom 0.152: v19.79,12.99 19.79,13.75 16.9,16.65 16.9,18.17 19.64,20.92 | 19.64,20.92 19.79,21.07 19.79,28.61 | 19.79,28.61 19.79,32.19 U$4.P$1 | 19.79,28.61 v21,28.61 | 19.64,20.92 v21.17,20.92
TX  (via drill 0.35)
  Top 0.152: v7.76,10.1 7.76,11.16 U$1.RXD | v17.05,31.43 20.1,31.43 21.01,30.52 22.39,30.52 28.33,36.46 31.68,36.46 U$2.TXD0
  Bottom 0.152: v7.76,10.1 7.76,20.15 17.05,29.45 v17.05,31.43
V_BAT  (via drill 0.35, 0.55)
  Top 0.152: 23.91,8.11 23.91,7.05 24.21,6.74 U$23.+ 24.37,6.44 v24.33,6.68 | 23.91,8.11 23.91,8.72 D6.A | 23.91,8.11 20.71,8.11 19.79,7.2 IC4.3 | C6.1 26.5,8.72 26.5,7.51 26.2,7.2 IC3.1 26.04,7.05 24.67,7.05 24.37,6.74 v24.33,6.68 | R21.1 32.14,12.23 32.14,9.94 33.82,8.27 35.8,8.27 36.56,7.51 C10.1 | v19.03,9.79 18.58,9.33 18.58,6.13 19.19,5.52 19.34,5.52 19.64,5.22 IC4.1 | IC3.3 26.04,5.22 25.43,5.22 24.37,6.29 v24.33,6.68
  Top 1.016: C9.1 7.24,39.72 U$8.1 | C11.2 38.44,39.89 U$12.1 | C10.1 38.44,5.92 U$10.1 | C5.1 7.26,6.25 U$13.1
  Bottom 0.152: v19.03,9.79 19.79,9.79 23.62,5.97
  Bottom 1.016: U$13.1 | U$13.1 23.08,5.43 23.62,5.97 v24.33,6.68 25.58,5.43 38.42,5.43 U$10.1 38.44,7.1 40.23,8.89 40.23,16.49 38.91,17.81 38.91,22.56 40.3,23.96 40.3,36.75 38.44,38.61 U$12.1 | U$8.1 7.24,38.71 5.81,37.28 5.8,37.28 5.35,36.83 5.35,23.93 6.75,22.53 6.75,17.78 5.35,16.38 5.35,8.82 7.26,6.91 U$13.1
  other vias: 7.26,5.43 38.44,5.45 7.24,40.36 38.44,40.34
V_SENS  (via drill 0.35)
  Top 0.152: 32.6,15.13 33.51,16.04 33.51,16.19 34.88,17.56 37.02,17.56 37.17,17.41 37.17,15.13 36.1,14.06 33.66,14.06 R25.1 | 32.6,15.13 32.14,14.67 32.14,14.06 R21.2 | v27.23,27.05 20.17,27.05 16.44,30.78 16.44,31.74 14.31,33.87 14,33.87 U$2.IO-34 | v31.99,18.94 31.99,15.73 32.6,15.13
  Bottom 0.152: v31.99,18.94 v27.23,27.05
VBUS  (via drill 0.35)
  Top 0.152: v9.74,31.28 9.74,31.74 9.13,32.35 8.52,32.35 J1.VBUS | U$1.VBUS 9.28,16.04 9.28,16.34 10.35,17.41 11.26,17.41 v11.57,17.11 10.96,17.11 v10.65,16.8 10.04,16.19 10.04,15.13 U$1.REGIN | 11.87,9.18 12.78,9.18 C15.1 | 11.87,9.18 11.11,9.18 C7.1 | 11.87,9.18 v11.87,10.25
  Route2 0.152: v11.57,17.11 11.57,17.72 11.87,18.02 11.87,31 11.59,31.28 v9.74,31.28 | v10.65,16.8 11.87,15.58 v11.87,10.25

### Text on the board
tPlace: + | + | - | - | FLASH | RESET | - | - | + | - | + | +
bPlace: CLK | MOSI | GND | CS | MISO | 3.3V | SPI | SDA | SCL | 3.3V | GND | I2C